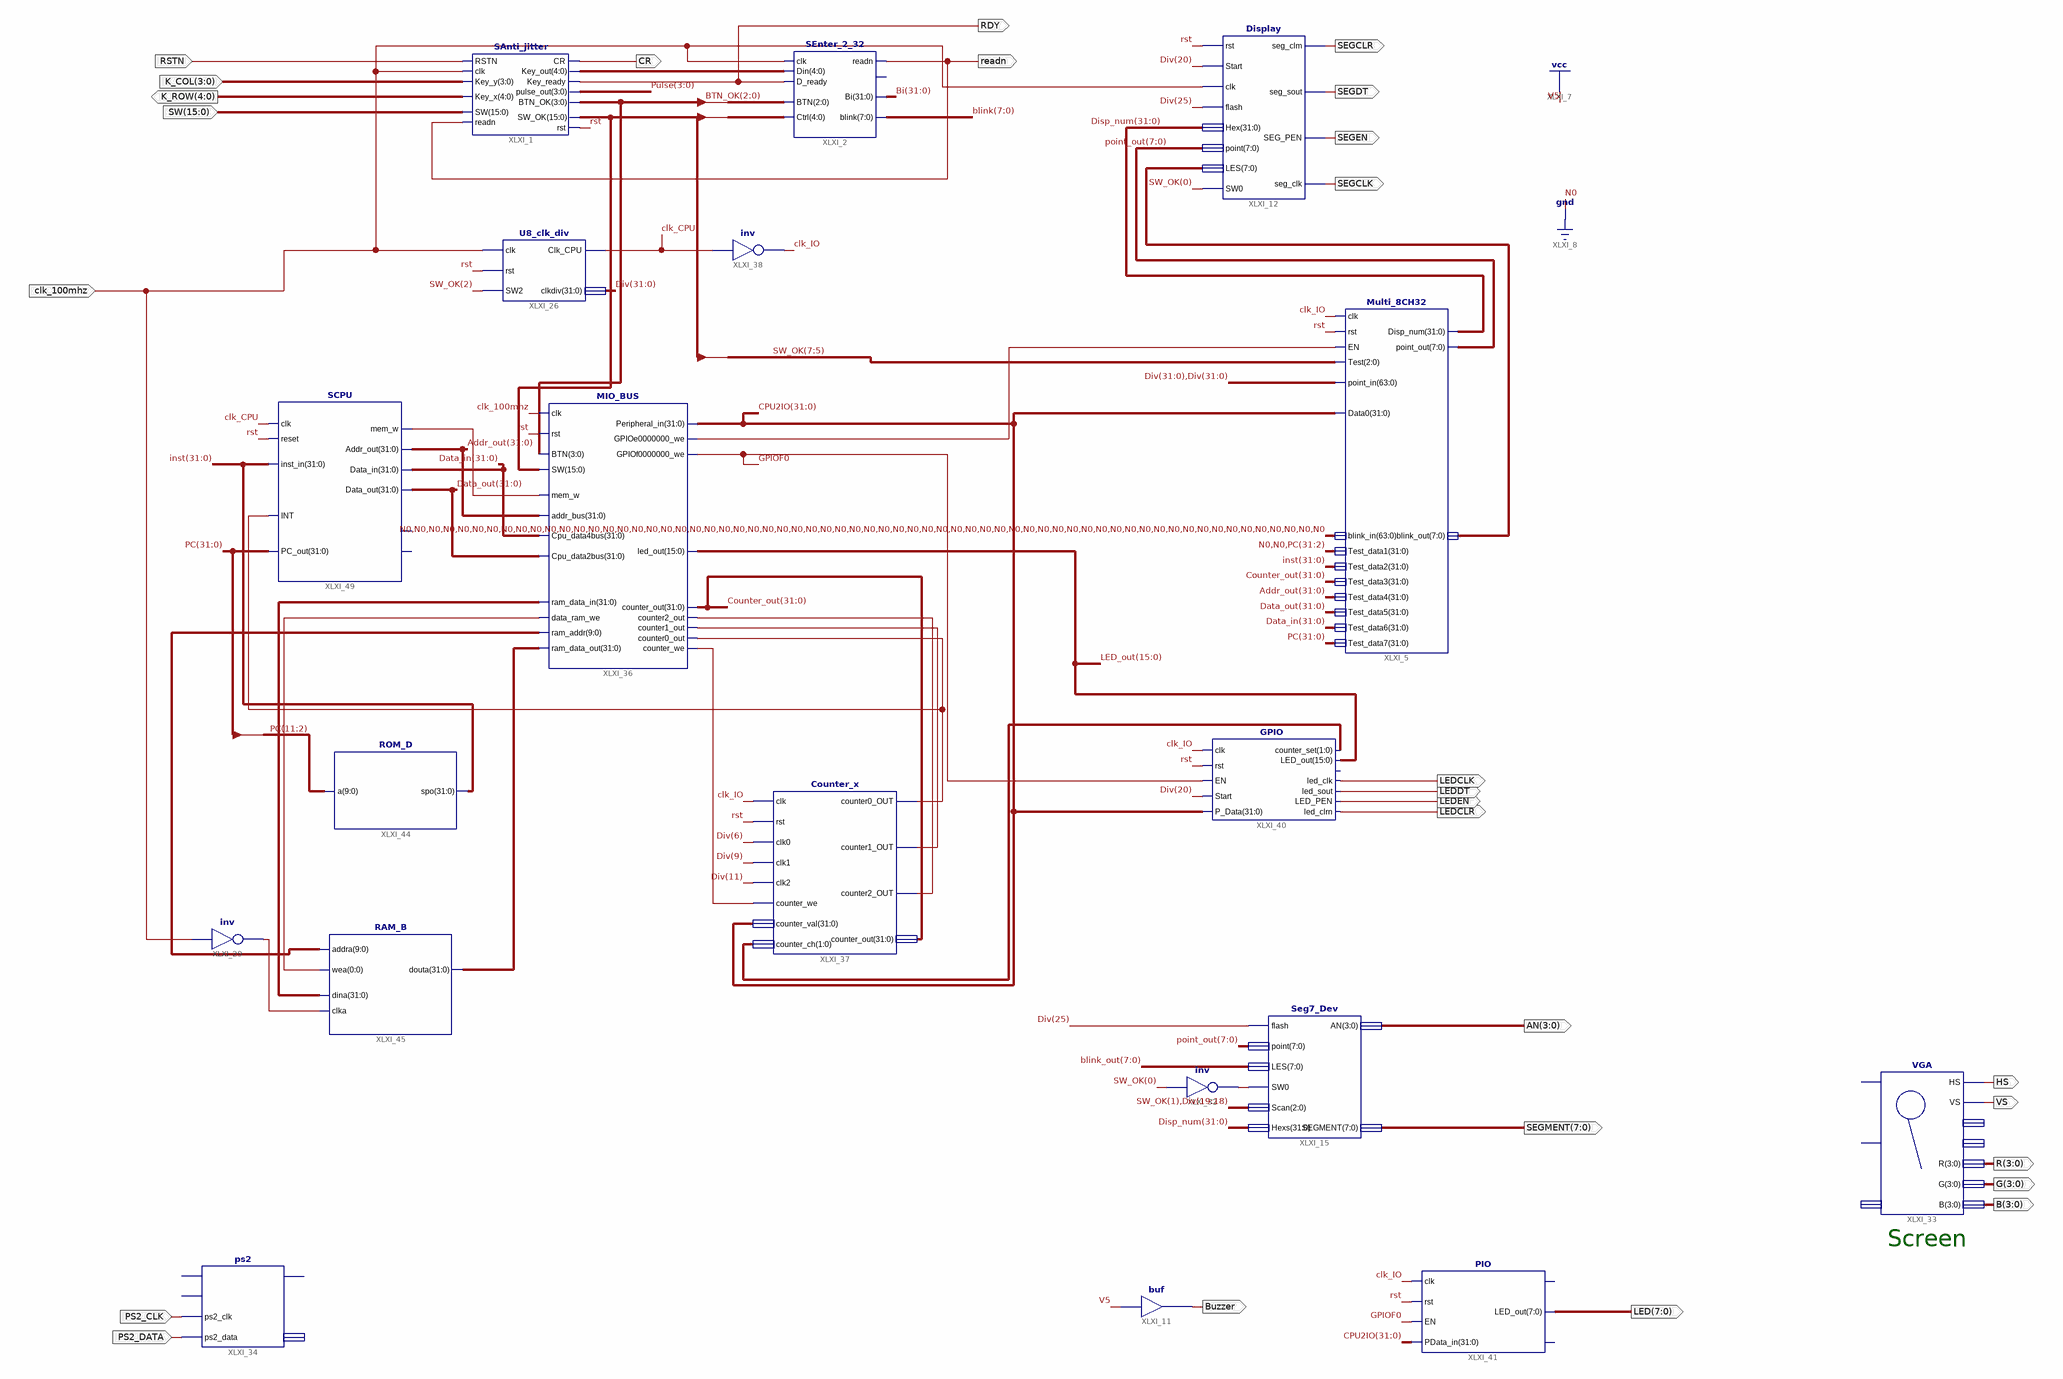
[diagram p0: schematic sheet 1]
// Xilinx ISE schematic Framework.sch (kintex7) as structural Verilog: 19 symbols, 27 ports
module Framework (
  input  RSTN,
  input  [3:0] K_COL,
  input  [15:0] SW,
  input  clk_100mhz,
  input  PS2_CLK,
  input  PS2_DATA,
  output [4:0] K_ROW,
  output readn,
  output CR,
  output RDY,
  output SEGCLR,
  output SEGDT,
  output SEGEN,
  output SEGCLK,
  output [3:0] AN,
  output [7:0] SEGMENT,
  output Buzzer,
  output LEDCLR,
  output LEDEN,
  output LEDDT,
  output LEDCLK,
  output [7:0] LED,
  output HS,
  output VS,
  output [3:0] R,
  output [3:0] G,
  output [3:0] B
);

  wire clk_CPU, clk_IO, GPIOF0, rst, XLXN_110, XLXN_125, XLXN_192, XLXN_215, XLXN_217, XLXN_218, XLXN_219,
       XLXN_228;
  wire [0:0] XLXN_222;
  wire [1:0] XLXN_209;
  wire [3:0] BTN_OK, Pulse;
  wire [4:0] XLXN_20;
  wire [7:0] blink, blink_out, point_out;
  wire [9:0] XLXN_223;
  wire [15:0] LED_out, SW_OK;
  wire [31:0] Addr_out, Bi, Counter_out, CPU2IO, Data_in, Data_out, Disp_num, Div, inst, PC, XLXN_220,
       XLXN_224;

  SAnti_jitter XLXI_1 (
    .SW(SW), .readn(readn), .Key_y(K_COL), .Key_x(K_ROW), .RSTN(RSTN), .clk(clk_100mhz), .Key_out(XLXN_20),
    .Key_ready(RDY), .CR(CR), .rst(rst), .SW_OK(SW_OK), .pulse_out(Pulse), .BTN_OK(BTN_OK));
  SEnter_2_32 XLXI_2 (
    .readn(readn), .Bi(Bi), .blink(blink), .Din(XLXN_20), .D_ready(RDY), .clk(clk_100mhz),
    .Ctrl({SW_OK[7:5], SW_OK[15], SW_OK[0]}), .BTN(BTN_OK[2:0]));  // open: Ai
  Multi_8CH32 XLXI_5 (
    .clk(clk_IO), .rst(rst), .EN(XLXN_228), .Test(SW_OK[7:5]), .point_in({Div, Div}), .blink_in({64{1'b0}}),
    .Data0(CPU2IO), .Test_data1({2'b00, PC[31:2]}), .Test_data2(inst), .Test_data3(Counter_out),
    .Test_data4(Addr_out), .Test_data5(Data_out), .Test_data6(Data_in), .Test_data7(PC),
    .point_out(point_out), .blink_out(blink_out), .Disp_num(Disp_num));
  buf XLXI_11 (Buzzer, 1'b1);
  Display XLXI_12 (
    .rst(rst), .Start(Div[20]), .clk(clk_100mhz), .flash(Div[25]), .Hex(Disp_num), .point(point_out),
    .LES(blink_out), .SW0(SW_OK[0]), .seg_clm(SEGCLR), .seg_sout(SEGDT), .SEG_PEN(SEGEN), .seg_clk(SEGCLK));
  Seg7_Dev XLXI_15 (
    .flash(Div[25]), .point(point_out), .LES(blink_out), .SW0(XLXN_125), .Scan({SW_OK[1], Div[19:18]}),
    .Hexs(Disp_num), .AN(AN), .SEGMENT(SEGMENT));
  U8_clk_div XLXI_26 (.clk(clk_100mhz), .rst(rst), .SW2(SW_OK[2]), .Clk_CPU(clk_CPU), .clkdiv(Div));
  not XLXI_29 (XLXN_110, clk_100mhz);
  not XLXI_32 (XLXN_125, SW_OK[0]);
  MIO_BUS XLXI_36 (
    .rst(rst), .clk(clk_100mhz), .mem_w(XLXN_192), .addr_bus(Addr_out), .Cpu_data4bus(Data_in),
    .Cpu_data2bus(Data_out), .ram_data_out(XLXN_224), .ram_addr(XLXN_223), .data_ram_we(XLXN_222[0]),
    .ram_data_in(XLXN_220), .counter_out(Counter_out), .counter2_out(XLXN_218), .counter1_out(XLXN_217),
    .counter0_out(XLXN_219), .counter_we(XLXN_215), .BTN(BTN_OK), .SW(SW_OK), .led_out(LED_out),
    .Peripheral_in(CPU2IO), .GPIOe0000000_we(XLXN_228), .GPIOf0000000_we(GPIOF0));
  Counter_x XLXI_37 (
    .clk(clk_IO), .rst(rst), .clk0(Div[6]), .clk1(Div[9]), .clk2(Div[11]), .counter_we(XLXN_215),
    .counter_val(CPU2IO), .counter_ch(XLXN_209), .counter0_OUT(XLXN_219), .counter1_OUT(XLXN_217),
    .counter2_OUT(XLXN_218), .counter_out(Counter_out));
  not XLXI_38 (clk_IO, clk_CPU);
  GPIO XLXI_40 (
    .clk(clk_IO), .rst(rst), .Start(Div[20]), .EN(GPIOF0), .P_Data(CPU2IO), .led_clk(LEDCLK),
    .led_sout(LEDDT), .led_clrn(LEDCLR), .LED_PEN(LEDEN), .counter_set(XLXN_209), .LED_out(LED_out));  // open: GPIOf0
  PIO XLXI_41 (.clk(clk_IO), .rst(rst), .EN(GPIOF0), .PData_in(CPU2IO), .LED_out(LED));  // open: counter_set, GPIOf0
  ROM_D XLXI_44 (.a(PC[11:2]), .spo(inst));
  RAM_B XLXI_45 (.addra(XLXN_223), .clka(XLXN_110), .wea(XLXN_222[0]), .dina(XLXN_220), .douta(XLXN_224));
  ps2 XLXI_34 (.ps2_clk(PS2_CLK), .ps2_data(PS2_DATA));  // open: clk, rst, ready, data_out
  VGA XLXI_33 (.HS(HS), .VS(VS), .R(R), .G(G), .B(B));  // open: clk, reset, Din, vga_x, vga_y
  SCPU XLXI_49 (
    .clk(clk_CPU), .reset(rst), .inst_in(inst), .INT(XLXN_219), .Addr_out(Addr_out), .mem_w(XLXN_192),
    .Data_out(Data_out), .Data_in(Data_in), .PC_out(PC));  // open: CPU_MIO, MIO_ready

  // Notes on the sheet:
  //   Screen
endmodule
